# Altium schematic sheet Power supply, dual - 2.5 V 250 mA - TI LM27762.SchDoc: Power supply dual; 2.5 V 250 mA
size A4; DrawnBy: J. de Bruijn; DocumentNumber: 26J16A; DocumentName: Power supply, dual; 2.5 V 250 mA; TI LM27762
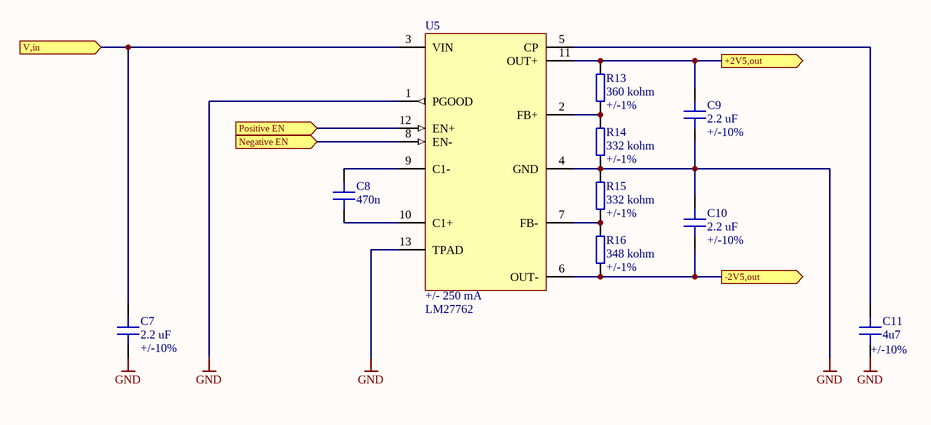
[diagram p0: Power supply, dual - 2.5 V 250 mA - TI LM27762.SchDoc]

## Parts
C7  value 2.2 uF  Tolerance: +/-10%  [Capacitor 0805 [2012 Metric]; SMT]  (hidden comment: Capacitor)
C8  value 470n  [Capacitor 0805 [2012 Metric]; SMT]  (hidden comment: Capacitor)
C9  value 2.2 uF  Tolerance: +/-10%  [Capacitor 0805 [2012 Metric]; SMT]  (hidden comment: Capacitor)
C10  value 2.2 uF  Tolerance: +/-10%  [Capacitor 0805 [2012 Metric]; SMT]  (hidden comment: Capacitor)
C11  value 4u7  Tolerance: +/-10%  [Capacitor 0805 [2012 Metric]; SMT]  (hidden comment: Capacitor)
R13  value 360 kohm  Tolerance: +/-1%  [Resistor 0805 [2012 Metric]; SMT]  (hidden comment: Resistor)
R14  value 332 kohm  Tolerance: +/-1%  [Resistor 0805 [2012 Metric]; SMT]  (hidden comment: Resistor)
R15  value 332 kohm  Tolerance: +/-1%  [Resistor 0805 [2012 Metric]; SMT]  (hidden comment: Resistor)
R16  value 348 kohm  Tolerance: +/-1%  [Resistor 0805 [2012 Metric]; SMT]  (hidden comment: Resistor)
U5  Output Current: +/- 250 mA  Part Number: LM27762  [R-PWSON-N12]  (hidden comment: TI LM27762)

## Ports
+2V5,out (out), -2V5,out (out), Negative EN (in), Positive EN (in), V,in (in)

## Nets
GND: C7.0 C9.0 C10.1 C11.0 R14.0 R15.1 U5.1(PGOOD) U5.4(GND) U5.13(TPAD)
+2V5,out: C9.1 R13.1 U5.11(OUT+) ; port +2V5,out
-2V5,out: C10.0 R16.0 U5.6(OUT-) ; port -2V5,out
Negative EN: U5.8(EN-) ; port Negative EN
Positive EN: U5.12(EN+) ; port Positive EN
V,in: C7.1 U5.3(VIN) ; port V,in
NetC8_0: C8.0 U5.10(C1+)
NetC8_1: C8.1 U5.9(C1-)
NetC11_1: C11.1 U5.5(CP)
NetR13_0: R13.0 R14.1 U5.2(FB+)
NetR15_0: R15.0 R16.1 U5.7(FB-)

## Notes on the sheet
- Title
- Size:
- Date:
- A4
- Number:
- Time:
- Revision:
- Sheet
- of
- File:
- DrawnBy:

## Library data of the parts
C7 C9 C10 = GRM21BR61H225KA73L: Manufacturer 1: Murata; Dielectric Characteristic: X5R; Voltage Rating: 50 V; Type: MLCC; SVHC: No SVHC; Part Number: GRM21BR61H225KA73L; Category: Capacitor; Package: 0805 [2012 Metric]; Operating Temperature Min: -55 degC; Operating Temperature Max: 85 degC; Pincount: 2; Mounting Style: Surface Mount; LatestRevision Date: 15/08/2016; Series: GRM Series; Author: Jeroen de Bruijn; RoHS Compliant: Compliant; Manufacturer Part Number 1: GRM21BR61H225KA73L; Supplier 1: Farnell; Supplier Part Number 1: 1845751
C8 = 0805B104J500CT: Dielectric Characteristic: X7R; Type: MLCC; SVHC: No SVHC; Category: Capacitor; Package: 0805 [2012 Metric]; Operating Temperature Min: -55 degC; Operating Temperature Max: 85 degC; Pincount: 2; Mounting Style: Surface Mount; LatestRevision Date: 24/07/2016; Author: Jeroen de Bruijn; RoHS Compliant: Compliant; Supplier 1: Farnell
C11 = 0805B475K160CT: Manufacturer 1: Walsin; Dielectric Characteristic: X7R; Voltage Rating: 16 V; Type: MLCC; SVHC: No SVHC; Part Number: 0805B475K160CT; Category: Capacitor; Package: 0805 [2012 Metric]; Operating Temperature Min: -55 degC; Operating Temperature Max: 85 degC; Pincount: 2; Mounting Style: Surface Mount; LatestRevision Date: 24/07/2016; Author: Jeroen de Bruijn; RoHS Compliant: Compliant; Manufacturer Part Number 1: 0805B475K160CT; Supplier 1: Farnell; Supplier Part Number 1: 2496988
R13 = MC01W08051360K: Manufacturer 1: Multicomp; Power Rating: 100 mW; Voltage Rating: 150 V; Temperature Coefficient: +/-100ppm/degC; SVHC: No SVHC; Part Number: MC01W08051360K; Category: Resistor; Package: 0805 [2012 Metric]; Operating Temperature Min: -55 degC; Operating Temperature Max: 155 degC; Mounting Style: Surface Mount; Pincount: 2; Packaging: Cut Tape (CT), Tape & Reel (TR); Type: Thick Film; LatestRevision Date: 11/08/2016; Series: MC Series; ComponentLink1URL: http://www.farnell.com/datasheets/1729047.pdf; ComponentLink1Description: Datasheet; Author: Jeroen de Bruijn; RoHS Compliant: Compliant; Manufacturer Part Number: MC01W08051360K; Supplier 1: Farnell; Supplier Part Number 1: 9333134; Supplier 2: Mouser; Supplier 3: Digi-Key
R14 R15 = MC01W08051332K: Manufacturer 1: Multicomp; Power Rating: 100 mW; Voltage Rating: 150 V; Temperature Coefficient: +/-100ppm/degC; SVHC: No SVHC; Part Number: MC01W08051332K; Category: Resistor; Package: 0805 [2012 Metric]; Operating Temperature Min: -55 degC; Operating Temperature Max: 155 degC; Mounting Style: Surface Mount; Pincount: 2; Packaging: Cut Tape (CT), Tape & Reel (TR); Type: Thick Film; LatestRevision Date: 11/08/2016; Series: MC Series; ComponentLink1URL: http://www.farnell.com/datasheets/1729047.pdf; ComponentLink1Description: Datasheet; Author: Jeroen de Bruijn; RoHS Compliant: Compliant; Manufacturer Part Number: MC01W08051332K; Supplier 1: Farnell; Supplier Part Number 1: 2141925; Supplier 2: Mouser; Supplier 3: Digi-Key
R16 = MC01W08051348K: Manufacturer 1: Multicomp; Power Rating: 100 mW; Voltage Rating: 150 V; Temperature Coefficient: +/-100ppm/degC; SVHC: No SVHC; Part Number: MC01W08051348K; Category: Resistor; Package: 0805 [2012 Metric]; Operating Temperature Min: -55 degC; Operating Temperature Max: 155 degC; Mounting Style: Surface Mount; Pincount: 2; Packaging: Cut Tape (CT), Tape & Reel (TR); Type: Thick Film; LatestRevision Date: 11/08/2016; Series: MC Series; ComponentLink1URL: http://www.farnell.com/datasheets/1729047.pdf; ComponentLink1Description: Datasheet; Author: Jeroen de Bruijn; RoHS Compliant: Compliant; Manufacturer Part Number: MC01W08051348K; Supplier 1: Farnell; Supplier Part Number 1: 2141926; Supplier 2: Mouser; Supplier 3: Digi-Key
U5 = LM27762: Manufacturer 1: Texas Instruments; Input Voltage Min: 2.7 V; Input Voltage Max: 5.5 V; Output Voltage Nom: +/- 1.5 V to +/- 5 V; Dropout Voltage Vdo: 45 mV; SVHC: No SVHC; Operating Temperature Min: –40 degC; Operating Temperature Max: 85 degC; Package: WSON-N12; Mounting Style: Surface Mount; Pincount: 8; LatestRevision Date: 24/10/2016; ComponentLink1URL: http://www.farnell.com/datasheets/1846304.pdf; ComponentLink1Description: Datasheet; Author: Jeroen de Bruijn; RoHS: Compliant; Manufacturer 1 Part No: LM27762; Supplier 1: Farnell; Supplier 2: Mouser; Supplier Part Number 2: 595-LM27762DSST; Supplier 3: Digikey